# EAGLE design 7segement3digits1badidea-mk-1.2 (EAGLE 7.5.0)
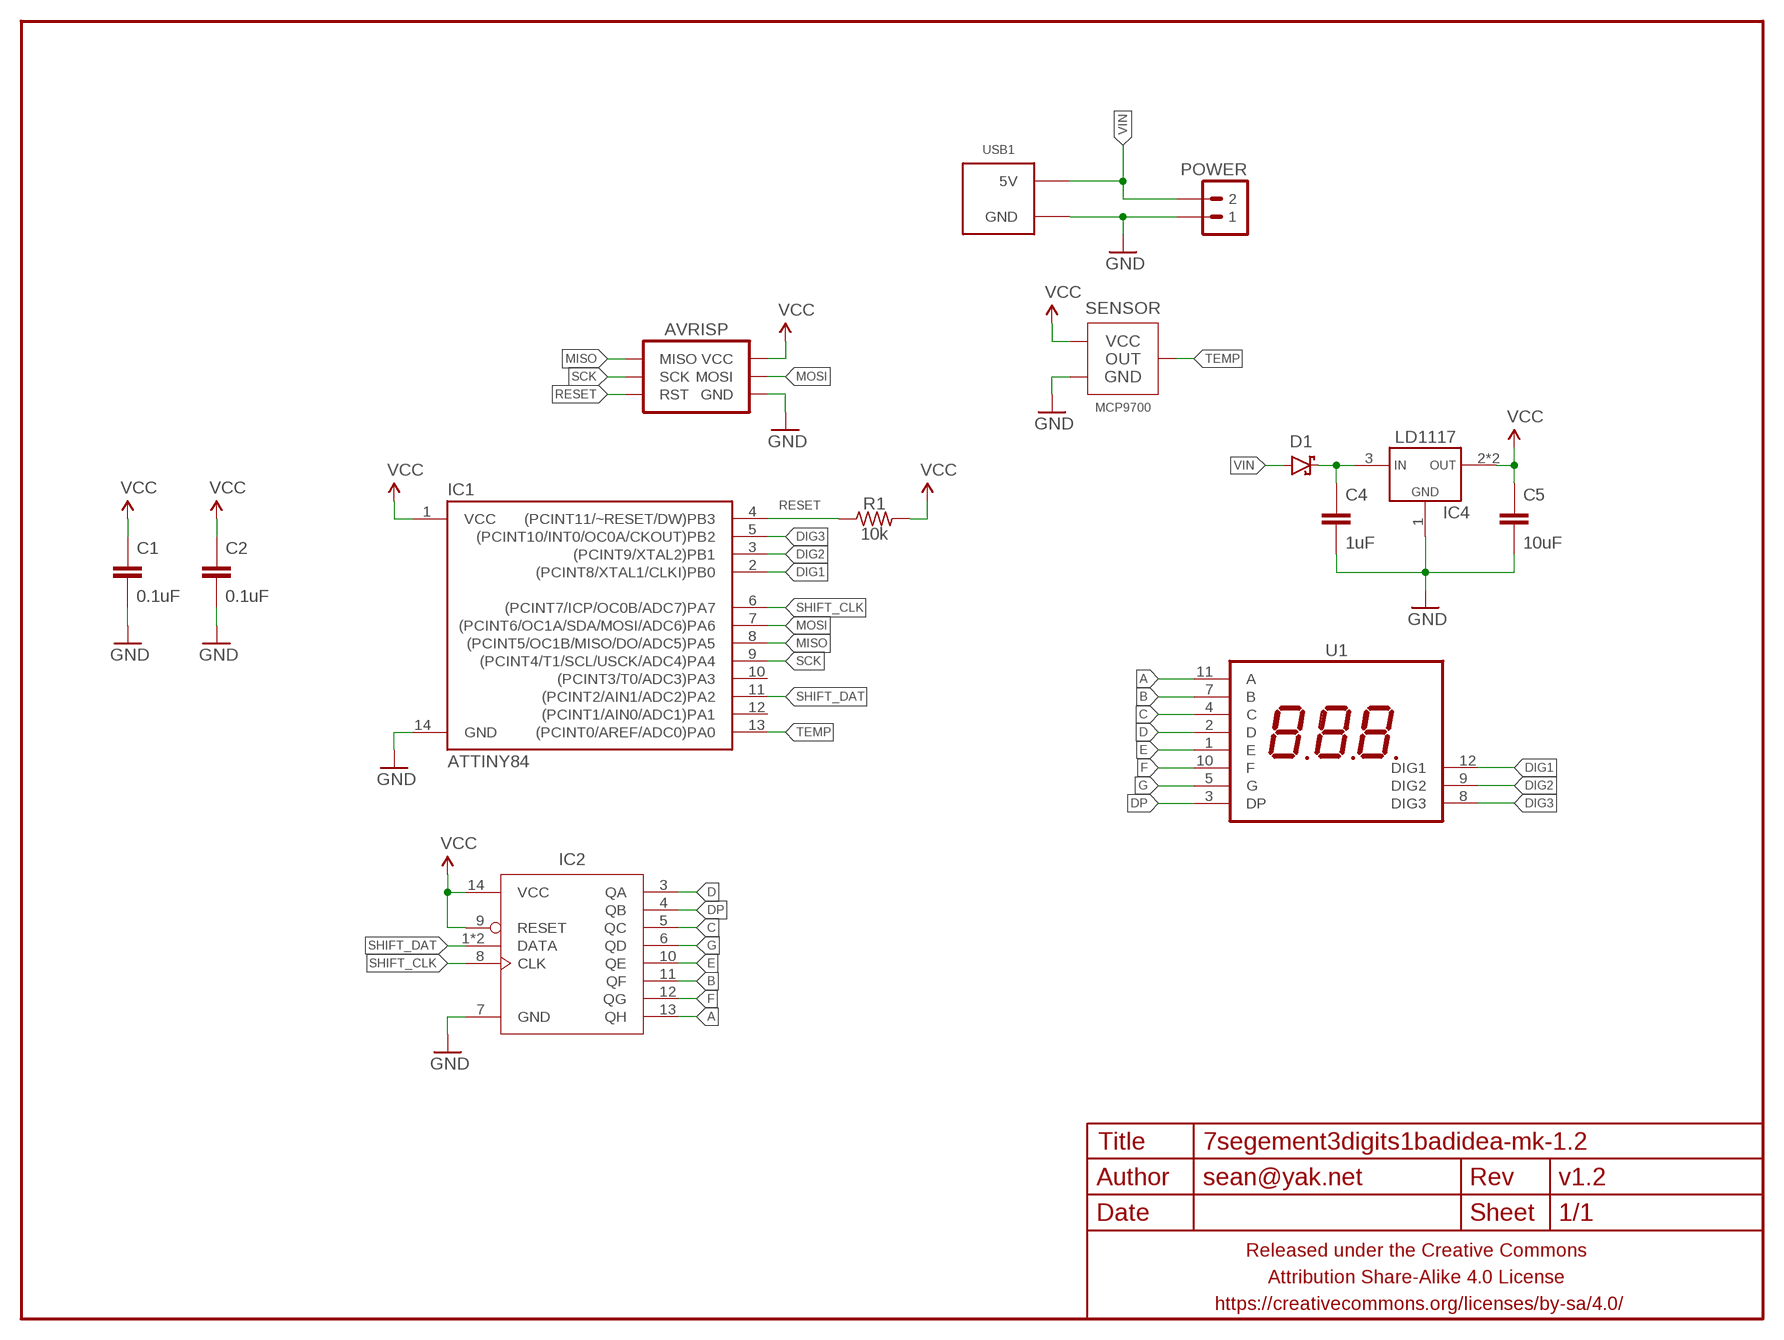
[diagram p0: schematic, sheet 1]

## Parts
AVRISP  AVR_SPI_PRG_6TESTPOINTS  [2X3_TEST_POINTS]
C1  0.1uF  CAPACITOR-CERAMICC0603  [C0603]
C2  0.1uF  CAPACITOR-CERAMICC0603  [C0603]
C4  1uF  CAPACITOR-CERAMICC0805  [C0805]
C5  10uF  CAPACITOR-CERAMICC0805  [C0805]
D1  DIODE-SCHOTTKYSOD123  [SOD123-SCHOTTKY]
FRAME1  FRAME-LETTERNO_PACKAGE  [DUMMY]
IC1  ATTINY84  [SO14]
IC2  74HC164  74164SOIC  [SO14]
IC4  LD1117  VREG_1117SOT223  [SOT223]
POWER  M02PTH-CENTERED-R+  [1X02-CENTER-R+]
R1  10k  RESISTORR0603  [R0603]
SENSOR  MCP9700  MCP9700TO-92-AMMO  [TO-92-AMMO]
U1  7SEG_3DIGIT  [7SEG_3DIG_0.56IN]
USB1  USB_AB_PWRONLY  [FCI-10103594-USB-MICRO-B-PWRONLY]

## Nets
A: IC2.13(QH) U1.11(A)
B: IC2.11(QF) U1.7(B)
C: IC2.5(QC) U1.4(C)
D: IC2.3(QA) U1.2(D)
DIG1: IC1.2((PCINT8/XTAL1/CLKI)PB0) U1.12(DIG1)
DIG2: IC1.3((PCINT9/XTAL2)PB1) U1.9(DIG2)
DIG3: IC1.5((PCINT10/INT0/OC0A/CKOUT)PB2) U1.8(DIG3)
DP: IC2.4(QB) U1.3(DP)
E: IC2.10(QE) U1.1(E)
F: IC2.12(QG) U1.10(F)
G: IC2.6(QD) U1.5(G)
GND: AVRISP.6(GND) C1.2 C2.2 C4.2 C5.2 IC1.14(GND) IC2.7(GND) IC4.1(GND) POWER.1 SENSOR.3(GND) USB1.5(GND) USB1.SHIELD@1(GND) USB1.SHIELD@2(GND) USB1.SHIELD@3(GND) USB1.SHIELD@4(GND)
MISO: AVRISP.1(MISO) IC1.8((PCINT5/OC1B/MISO/DO/ADC5)PA5)
MOSI: AVRISP.4(MOSI) IC1.7((PCINT6/OC1A/SDA/MOSI/ADC6)PA6)
N$4: C4.1 D1.C IC4.3(VIN)
RESET: AVRISP.5(RST) IC1.4((PCINT11/~RESET/DW)PB3) R1.1
SCK: AVRISP.3(SCK) IC1.9((PCINT4/T1/SCL/USCK/ADC4)PA4)
SHIFT_CLK: IC1.6((PCINT7/ICP/OC0B/ADC7)PA7) IC2.8(CLK)
SHIFT_DAT: IC1.11((PCINT2/AIN1/ADC2)PA2) IC2.1(DATA) IC2.2(DATA)
TEMP: IC1.13((PCINT0/AREF/ADC0)PA0) SENSOR.2(OUT)
VCC: AVRISP.2(VCC) C1.1 C2.1 C5.1 IC1.1(VCC) IC2.9(RESET) IC2.14(VCC) IC4.2(VOUT) IC4.4(VOUT) R1.2 SENSOR.1(VCC)
VIN: D1.A POWER.2 USB1.1(5V)
Unconnected: IC1.10((PCINT3/T0/ADC3)PA3) IC1.12((PCINT1/AIN0/ADC1)PA1)

## Library data of the parts
AVRISP = A_butts:AVR_SPI_PRG_6: AVR ISP 6 Pin This is the reduced ISP connector for AVR programming. Common on Arduino. This footprint will take up less PCB space and can be used with a 10-pin to 6-pin adapter such as SKU: BOB-08508 **Special note about "TEST_POINT" package. The stop mask is on the top side, so if you want your programming test points to be on the bottom of your board, make sure to place this package on the bottom side of the board. This also ensure that the orientation to program from the bottom side will be correct.
C1 C2 C4 C5 = A_butts:CAPACITOR-CERAMIC: CAPACITOR, European symbol
D1 = a_parts:DIODE-SCHOTTKY: Schottky diodes in SFE's production catalog BAT20J 1A 23V 0.62Vf RB751 120mA 40V 0.37Vf PMEG4005EJ 0.5A 40V 0.42Vf MBRA140 1A 40V 0.5Vf B340A 3A 40V SMA
FRAME1 = A_butts:FRAME-LETTER: Schematic Frame Standard 8.5x11 US Letter frame; DESIGNER: sean@yak.net; VERSION: v1.2
IC1 = A_butts:ATTINY84: Atmel 14-pin 2/4/8kB flash uC
IC2 = a_parts:74*164
IC4 = a_parts:VREG_1117
POWER = A_butts:M02: Standard 2-pin 0.1" header. Use with - straight break away headers ( PRT-00116) - right angle break away headers (PRT-00553) - swiss pins (PRT-00743) - machine pins (PRT-00117) - female headers (PRT-00115) Molex polarized connector foot print use with: PRT-08233 with associated crimp pins and housings. 2.54_SCREWTERM for use with PRT-10571. 3.5mm Screw Terminal footprints for PRT-08084 5mm Screw Terminal footprints for use with PRT-08433
R1 = A_butts:RESISTOR: RESISTOR, American symbol
SENSOR = a_parts:MCP9700
U1 = a_parts:7SEG_3DIGIT
USB1 = A_butts:USB_AB_PWRONLY

## Board
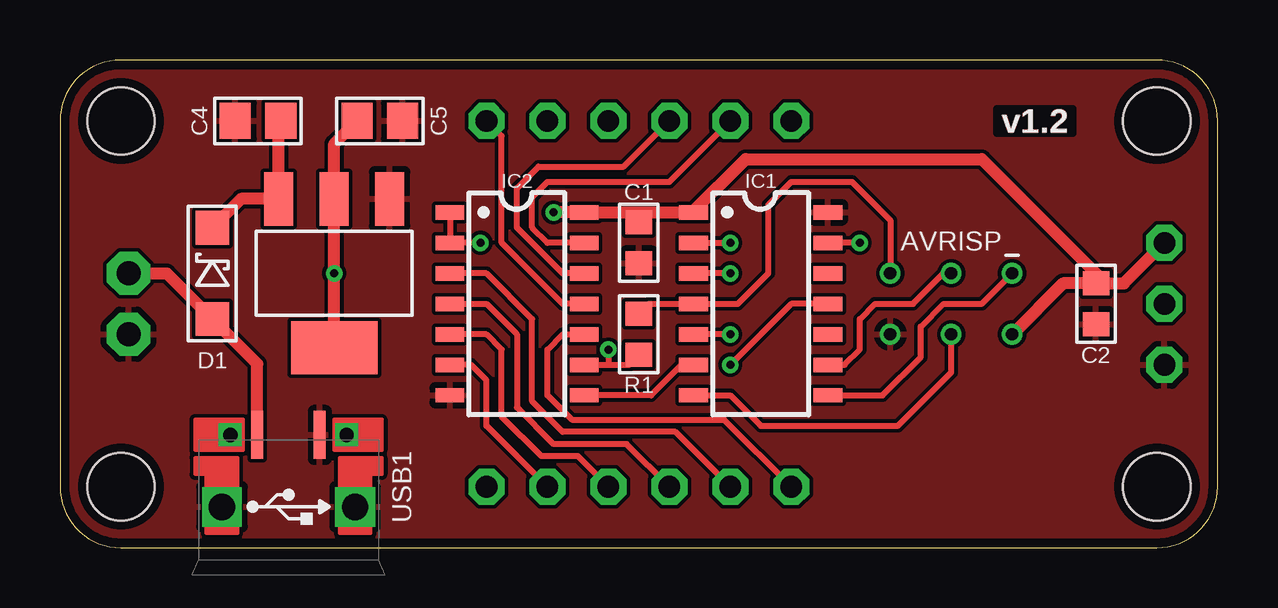
[diagram p1: board, top side]
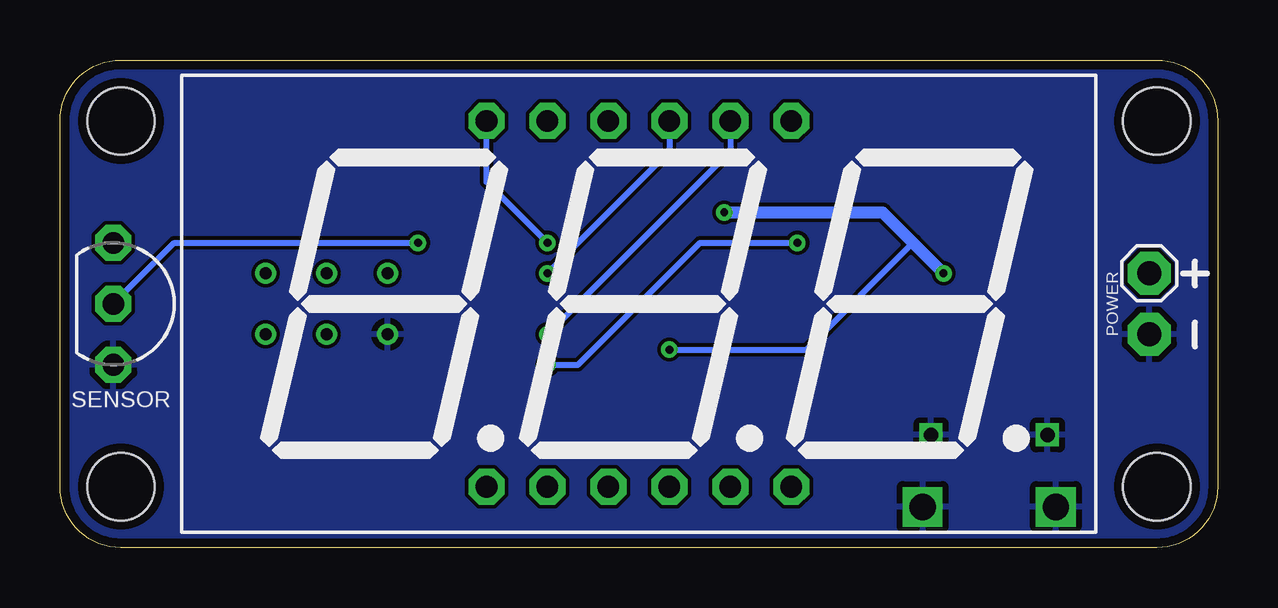
[diagram p2: board, bottom side, seen from below]

Size 48.26 x 20.32 mm. Coordinates in mm from the lower left corner, seen from the top.
Outline: 0,17.78 0,2.54 arc90 2.54,0 45.72,0 arc90 48.26,2.54 48.26,17.78 arc90 45.72,20.32 2.54,20.32 arc90 0,17.78
Copper layers (1*16): Top 0.0356mm / dielectric 1.5011mm / Bottom 0.0356mm
Design rules "LaenPCBOrder_2": minimum track width 6mil, minimum drill 13mil, track to track 6mil, track to pad 6mil, pad to pad 6mil, via to via 6mil, smd to smd 6mil, copper to edge 15mil, drill to drill 6mil, minimum pad ring 7mil, minimum via ring 7mil, stop-mask expansion 3mil, vias tented up to drill 20mil, thermal gap 10mil
Holes 2.8 mm at 2.54,2.54 45.72,17.78 2.54,17.78 45.72,2.54

### Footprints (pad centres in the part's own frame; a part is rotated, then mirrored left to right if it is on the bottom)
2X3_TEST_POINTS = drill 0.508: 1 -2.54,-1.27; 2 -2.54,1.27; 3 0,-1.27; 4 0,1.27; 5 2.54,-1.27; 6 2.54,1.27
C0603 = smd 1 x 1.1: 1 -0.85,0; 2 0.85,0
C0805 = smd 1.3 x 1.5: 1 -0.95,0; 2 0.95,0
SOD123-SCHOTTKY = smd 1.4 x 1.4: A -1.9,0; C 1.9,0
SO14 = smd 0.6 x 1.2: 1 -3.81,-2.8; 2 -2.54,-2.8; 3 -1.27,-2.8; 4 0,-2.8; 5 1.27,-2.8; 6 2.54,-2.8; 7 3.81,-2.8; 8 3.81,2.8; 9 2.54,2.8; 10 1.27,2.8; 11 0,2.8; 12 -1.27,2.8; 13 -2.54,2.8; 14 -3.81,2.8
SOT223 = smd 1.219 x 2.235: 1 -2.311,-3.099; 2 0,-3.099; 3 2.311,-3.099 | smd 3.6 x 2.2: 4 0,3.099
1X02-CENTER-R+ = drill 1 pad 1.8 octagon: 1 -1.27,0; 2 1.27,0
R0603 = smd 1 x 1.1: 1 -0.85,0; 2 0.85,0
TO-92-AMMO = drill 0.9 pad 1.5 octagon: 1 -2.54,0; 2 0,0; 3 2.54,0
7SEG_3DIG_0.56IN = drill 0.9 pad 1.5 octagon: 1 -6.35,-7.62; 2 -3.81,-7.62; 3 -1.27,-7.62; 4 1.27,-7.62; 5 3.81,-7.62; 6 6.35,-7.62; 7 6.35,7.62; 8 3.81,7.62; 9 1.27,7.62; 10 -1.27,7.62; 11 -3.81,7.62; 12 -6.35,7.62
FCI-10103594-USB-MICRO-B-PWRONLY = smd 0.5 x 2: 1 -1.3,3; 5 1.3,3 | drill 0.6 square: SHIELD@1 -2.425,3; SHIELD@2 2.425,3 | drill 1.1 pad 1.3 square: SHIELD@3 -2.775,0; SHIELD@4 2.775,0

### Placement (x,y rotation side)
AVRISP  37.15,10.16 180 top
C1  24.13,12.7 270 top
C2  43.18,10.16 270 top
C4  8.26,17.78 180 top
C5  13.34,17.78 0 top
D1  6.35,11.43 90 top
FRAME1  0,-0.5 0 top
IC1  29.21,10.16 270 top
IC2  19.05,10.16 270 top
IC4  11.43,11.43 180 top
POWER  2.86,10.16 90 bottom
R1  24.13,8.89 270 top
SENSOR  46.04,10.16 270 bottom
U1  24.13,10.16 0 bottom
USB1  9.53,1.7 0 top

### Tracks (layer width: path | path; a pad name or v marks a point on that pad's centre or on a via)
A
  Top 0.254: IC2.13 20.32,12.7 19.68,13.34 19.68,14.61 20.32,15.24 25.4,15.24 U1.11
B
  Top 0.254: IC2.11 20.95,10.16 18.41,12.7 18.41,17.14 U1.7
C
  Top 0.254: U1.4 21.59,3.81 20.07,3.81 18.41,5.46 18.41,8.26 17.78,8.89 IC2.5
D
  Top 0.254: U1.2 25.65,4.83 20.95,4.83 19.68,6.1 19.68,9.53 17.78,11.43 IC2.3
DIG1  (via drill 0.33)
  Top 0.254: IC1.2 v27.94,12.7
  Bottom 0.254: v27.94,12.7 30.48,15.24 U1.12
DIG2  (via drill 0.33)
  Top 0.254: v27.94,11.43 IC1.3
  Bottom 0.254: U1.9 22.86,16.51 v27.94,11.43
DIG3  (via drill 0.33)
  Top 0.254: v27.94,8.89 IC1.5
  Bottom 0.254: U1.8 20.32,16.51 v27.94,8.89
DP
  Top 0.254: U1.3 23.62,4.32 20.57,4.32 19.05,5.84 19.05,8.89 17.78,10.16 IC2.4
E
  Top 0.254: U1.1 27.69,5.33 21.34,5.33 20.32,6.35 20.32,8.26 20.95,8.89 IC2.10
F
  Top 0.254: IC2.12 20.95,11.43 19.05,13.34 19.05,14.99 19.94,15.88 23.5,15.88 U1.10
G
  Top 0.254: U1.5 17.78,5.08 17.78,6.99 17.14,7.62 IC2.6
GND
  pour Top: 0,0 0,20.32 48.26,20.32 48.26,0
  pour Bottom: 0,0 0,20.32 48.26,20.32 48.26,0
MISO
  Top 0.254: IC1.8 34.29,6.35 35.88,7.94 35.88,9.21 36.83,10.16 38.42,10.16 AVRISP.1
MOSI
  Top 0.254: IC1.7 27.94,6.35 29.21,5.08 34.92,5.08 37.15,7.3 AVRISP.4
N$4
  Top 0.508: C4.1 9.12,17.69 IC4.3 7.55,14.53 D1.C
RESET
  Top 0.254: R1.1 24.55,10.16 IC1.4 28.26,10.16 29.53,11.43 29.53,14.29 30.48,15.24 33.02,15.24 34.61,13.65 AVRISP.5
SCK
  Top 0.254: IC1.9 32.7,7.62 33.34,8.26 33.34,9.53 33.97,10.16 35.56,10.16 36.83,11.43 AVRISP.3
SHIFT_CLK
  Top 0.254: IC1.6 25.91,7.62 24.64,6.35 IC2.8
SHIFT_DAT  (via drill 0.33)
  Top 0.254: IC1.11 30.48,10.16 v27.94,7.62 | IC2.1 IC2.2 v17.53,12.7
  Bottom 0.254: v27.94,7.62 26.67,7.62 21.59,12.7 v17.53,12.7
TEMP  (via drill 0.33)
  Top 0.254: v33.34,12.7 IC1.13
  Bottom 0.254: SENSOR.2 43.5,12.7 v33.34,12.7
VCC  (via drill 0.33)
  Top 0.254: IC2.9 22.86,7.62 | 22.86,7.62 23.71,7.62 R1.2 | v22.86,8.26 22.86,7.62
  Top 0.508: IC4.4 v11.43,11.43 IC4.2 11.43,16.82 C5.1 | v20.57,13.97 IC2.14 24.13,13.97 | 24.13,13.97 26.35,13.97 | C1.1 24.13,13.97 | C2.1 41.81,11.01 AVRISP.2 | C2.1 44.35,11.01 SENSOR.1 | IC1.1 26.35,13.97 | 26.35,13.97 28.57,16.19 38.42,16.19 43.18,11.43 C2.1
  Bottom 0.254: v22.86,8.26 17.14,8.26 12.7,12.7
  Bottom 0.508: v20.57,13.97 13.97,13.97 12.7,12.7 v11.43,11.43
VIN
  Top 0.508: USB1.1 8.22,7.66 D1.A 4.45,11.43 POWER.2